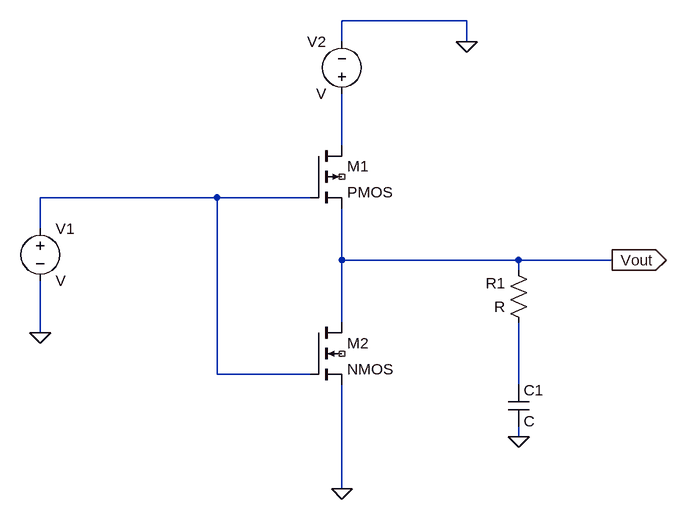
[diagram p0: schematic PartA CMOS Inverter.asc]
PartA CMOS Inverter.asc, the LTspice schematic file:
Version 4.1
SHEET 1 880 756
WIRE 288 16 96 16
WIRE 96 48 96 16
WIRE 288 48 288 16
WIRE 96 208 96 128
WIRE -96 288 -368 288
WIRE 48 288 -96 288
WIRE -368 336 -368 288
WIRE 96 384 96 304
WIRE 368 384 96 384
WIRE 512 384 368 384
WIRE 368 400 368 384
WIRE 96 480 96 384
WIRE -368 496 -368 416
WIRE -96 560 -96 288
WIRE 48 560 -96 560
WIRE 368 576 368 480
WIRE 368 656 368 640
WIRE 96 736 96 576
FLAG 288 48 0
FLAG 96 736 0
FLAG 512 384 Vout
IOPIN 512 384 Out
FLAG -368 496 0
FLAG 368 656 0
SYMBOL voltage -368 320 R0
SYMATTR InstName V1
SYMBOL pmos4 48 208 R0
SYMATTR InstName M1
SYMBOL nmos4 48 480 R0
SYMATTR InstName M2
SYMBOL res 384 496 R180
WINDOW 0 36 76 Left 2
WINDOW 3 36 40 Left 2
SYMATTR InstName R1
SYMBOL cap 352 576 R0
SYMATTR InstName C1
SYMBOL voltage 96 144 R180
WINDOW 0 24 96 Left 2
WINDOW 3 24 16 Left 2
SYMATTR InstName V2

The netlist it stands for:
* PartA CMOS Inverter.asc
V1 N002 0 V
M1 N001 N002 Vout NC_01 PMOS
M2 Vout N002 0 NC_02 NMOS
R1 N003 Vout R
C1 N003 0 C
V2 N001 0 V
.model NMOS NMOS
.model PMOS PMOS
.lib standard.mos
.backanno
.end